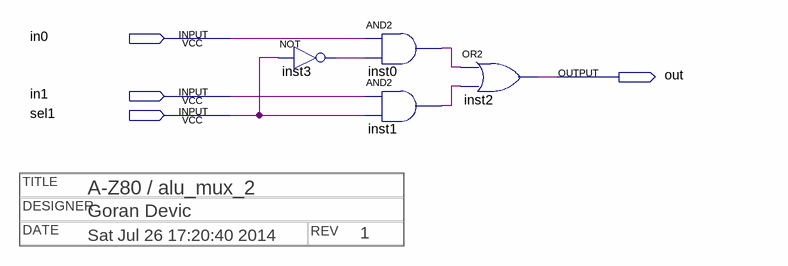
[diagram p0: schematic sheet]
// Quartus schematic alu_mux_2.bdf as structural Verilog: 4 symbols, 4 pins
// Title block: DATE: Sat Jul 26 17:20:40 2014; DESIGNER: Goran Devic; REV: 1; TITLE: A-Z80 / alu_mux_2
module alu_mux_2 (
  input  in0,
  input  in1,
  input  sel1,
  output out
);

  wire inst0_out, inst1_out, inst3_out;

  not inst3 (inst3_out, sel1);
  and inst0 (inst0_out, in0, inst3_out);
  and inst1 (inst1_out, in1, sel1);
  or inst2 (out, inst0_out, inst1_out);
endmodule
